# EAGLE design pcie-led (EAGLE 7.6.0)
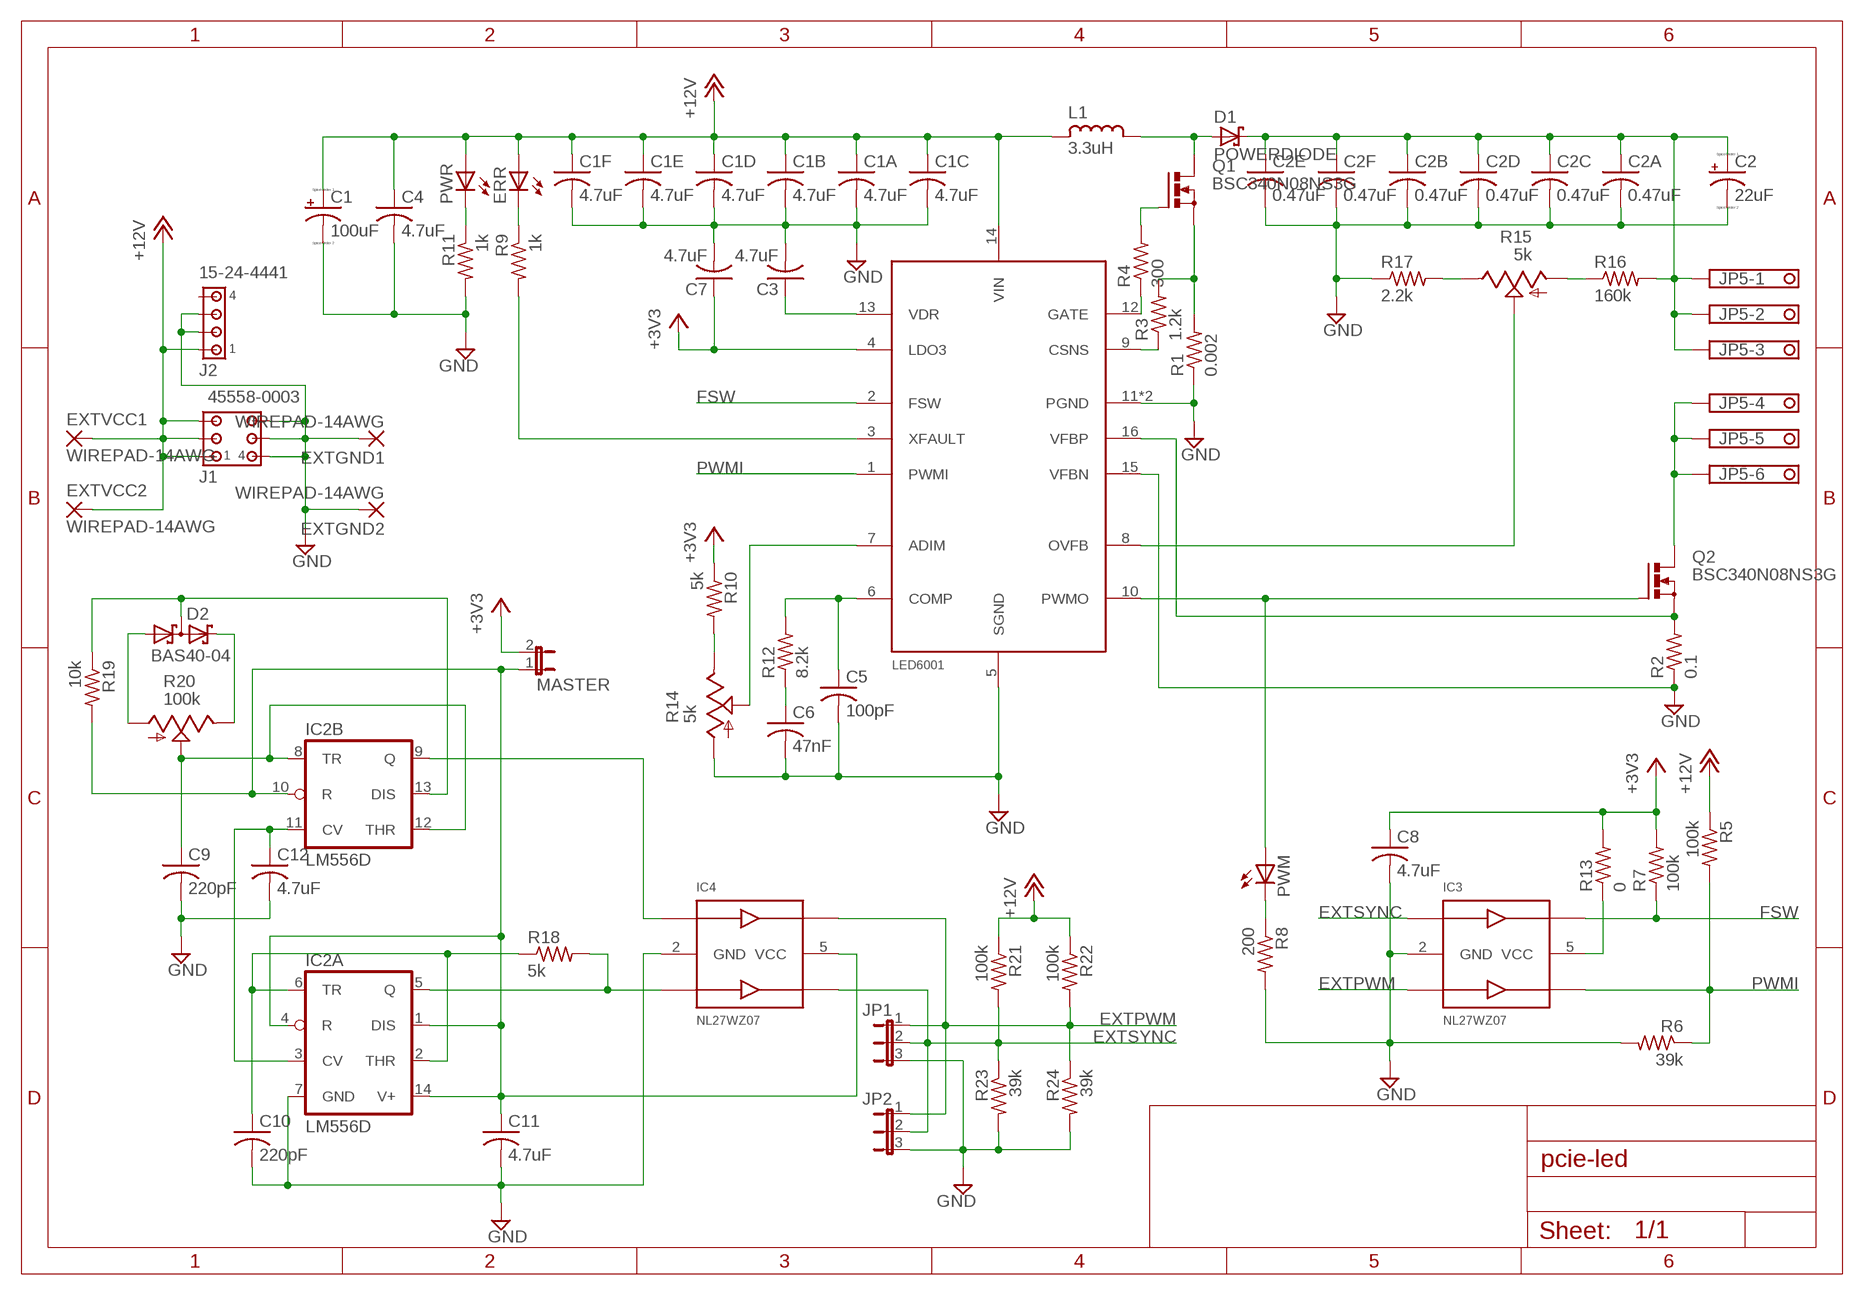
[diagram p0: schematic, sheet 1]

## Parts
C1  100uF  CPOL-USE3.5-8  [E3,5-8]
C1A  4.7uF  C-USC0805  [C0805]
C1B  4.7uF  C-USC0805  [C0805]
C1C  4.7uF  C-USC0805  [C0805]
C1D  4.7uF  C-USC0805  [C0805]
C1E  4.7uF  C-USC0805  [C0805]
C1F  4.7uF  C-USC0805  [C0805]
C2  22uF  CPOL-USE3.5-8  [E3,5-8]
C2A  0.47uF  C-USC0805  [C0805]
C2B  0.47uF  C-USC0805  [C0805]
C2C  0.47uF  C-USC0805  [C0805]
C2D  0.47uF  C-USC0805  [C0805]
C2E  0.47uF  C-USC0805  [C0805]
C2F  0.47uF  C-USC0805  [C0805]
C3  4.7uF  C-USC0603  [C0603]
C4  4.7uF  C-USC0603  [C0603]
C5  100pF  C-USC0603  [C0603]
C6  47nF  C-USC0603  [C0603]
C7  4.7uF  C-USC0603  [C0603]
C8  4.7uF  C-USC0603  [C0603]
C9  220pF  C-USC0603  [C0603]
C10  220pF  C-USC0603  [C0603]
C11  4.7uF  C-USC0603  [C0603]
C12  4.7uF  C-USC0603  [C0603]
D1  POWERDIODE  [LFPACK56-TO277]
D2  BAS40-04  [SOT23]
ERR  LEDCHIP-LED0805  [CHIP-LED0805]
EXTGND1  WIREPAD-14AWG  [WIREPAD-14AWG]
EXTGND2  WIREPAD-14AWG  [WIREPAD-14AWG]
EXTVCC1  WIREPAD-14AWG  [WIREPAD-14AWG]
EXTVCC2  WIREPAD-14AWG  [WIREPAD-14AWG]
IC1  LED6001  [HTSSOP-16]
IC2  LM556D  [SO14]
IC3  NL27WZ07  [SOT363]
IC4  NL27WZ07  [SOT363]
J1  45558-0003  [45558-0003]
J2  15-24-4441  [15-24-4441]
JP1  JP2E  [JP2]
JP2  JP2E  [JP2]
JP5  OSTTE06  [OSTTE06]
L1  3.3uH  SRP1770TA  [SRP1770TA]
MASTER  JP1E  [JP1]
PWM  LEDCHIP-LED0805  [CHIP-LED0805]
PWR  LEDCHIP-LED0805  [CHIP-LED0805]
Q1  BSC340N08NS3G  [PG-TDSON-8]
Q2  BSC340N08NS3G  [PG-TDSON-8]
R1  0.002  R-US_R1206  [R1206]
R2  0.1  R-US_R2512  [R2512]
R3  1.2k  R-US_R0603  [R0603]
R4  300  R-US_R0603  [R0603]
R5  100k  R-US_R0603  [R0603]
R6  39k  R-US_R0603  [R0603]
R7  100k  R-US_R0603  [R0603]
R8  200  R-US_R0603  [R0603]
R9  1k  R-US_R0603  [R0603]
R10  5k  R-US_R0603  [R0603]
R11  1k  R-US_R0603  [R0603]
R12  8.2k  R-US_R0603  [R0603]
R13  0  R-US_R0603  [R0603]
R14  5k  ST4ETB  [ST-4EB]
R15  5k  ST4ETB  [ST-4EB]
R16  160k  R-US_R0603  [R0603]
R17  2.2k  R-US_R0603  [R0603]
R18  5k  R-US_R0603  [R0603]
R19  10k  R-US_R0603  [R0603]
R20  100k  P260T  [P260T]
R21  100k  R-US_R0603  [R0603]
R22  100k  R-US_R0603  [R0603]
R23  39k  R-US_R0603  [R0603]
R24  39k  R-US_R0603  [R0603]

## Nets
+3V3: C7.1 C8.1 IC1.4(LDO3) MASTER.2 R7.2 R10.1 R13.2
+12V: C1.+ C1A.1 C1B.1 C1C.1 C1D.1 C1E.1 C1F.1 C4.1 ERR.A EXTVCC1.TP(P) EXTVCC2.TP(P) IC1.14(VIN) J1.1 J1.2 J1.3 J2.1 L1.P$1 PWR.A R5.1 R21.1 R22.1
CSNS: Q1.1(S) Q1.2(S) Q1.3(S) R1.2 R3.2
EXTPWM: IC3.3(IN2) IC4.6(OUT1) JP1.1 JP2.1 R22.2 R24.1
EXTSYNC: IC3.1(IN1) IC4.4(OUT2) JP1.2 JP2.2 R21.2 R23.1
FSW: IC1.2(FSW) IC3.6(OUT1) R7.1
GND: C1.- C1A.2 C1B.2 C1C.2 C1D.2 C1E.2 C1F.2 C2.- C2A.2 C2B.2 C2C.2 C2D.2 C2E.2 C2F.2 C3.2 C4.2 C5.2 C6.2 C7.2 C8.2 C9.2 C10.2 C11.2 C12.2 EXTGND1.TP(P) EXTGND2.TP(P) IC1.5(SGND) IC1.11(PGND) IC1.15(VFBN) IC1.PAD(PGND) IC2.7(A:GND) IC3.2(GND) IC4.2(GND) J1.4 J1.5 J1.6 J2.2 J2.3 JP1.3 JP2.3 R1.1 R2.1 R6.2 R8.2 R11.2 R14.1(A) R17.1 R23.2 R24.2
L+: D1.A L1.P$2 Q1.5(D) Q1.6(D) Q1.7(D) Q1.8(D) Q1.TH(D)
LED+: C2.+ C2A.1 C2B.1 C2C.1 C2D.1 C2E.1 C2F.1 D1.C1(C) D1.C2(C) D1.C3(C) D1.C4(C) D1.TH(C) JP5.1 JP5.2 JP5.3 R16.2
LED-: JP5.4 JP5.5 JP5.6 Q2.5(D) Q2.6(D) Q2.7(D) Q2.8(D) Q2.TH(D)
N$1: PWM.C R8.1
N$2: IC1.10(PWMO) PWM.A Q2.4(G)
N$3: Q1.4(G) R4.2
N$4: C11.1 IC2.1(A:DIS) IC2.4(A:R) IC2.10(B:R) IC2.14(A:V+) IC4.5(VCC) MASTER.1 R19.2
N$5: IC1.12(GATE) R4.1
N$6: IC2.5(A:Q) IC4.3(IN2) R18.2
N$7: R15.1(A) R16.1
N$8: IC2.9(B:Q) IC4.1(IN1)
N$9: C5.1 IC1.6(COMP) R12.2
N$10: C6.1 R12.1
N$11: IC1.8(OVFB) R15.2(S)
N$12: IC1.7(ADIM) R14.2(S)
N$13: R15.3(E) R17.2
N$14: R10.2 R14.3(E)
N$15: IC1.9(CSNS) R3.1
N$16: IC3.5(VCC) R13.1
N$18: C12.1 IC2.3(A:CV) IC2.11(B:CV)
N$21: C10.1 IC2.2(A:THR) IC2.6(A:TR) R18.1
N$22: ERR.C R9.1
N$23: D2.2(C2) R20.3(E)
N$24: D2.1(A1) R20.1(A)
N$25: C9.1 IC2.8(B:TR) IC2.12(B:THR) R20.2(S)
N$26: D2.3(C1A2) IC2.13(B:DIS) R19.1
N$27: PWR.C R11.1
N$29: C3.1 IC1.13(VDR)
PWMI: IC1.1(PWMI) IC3.4(OUT2) R5.2 R6.1
VFBP: IC1.16(VFBP) Q2.1(S) Q2.2(S) Q2.3(S) R2.2
XFAULT: IC1.3(XFAULT) R9.2
Unconnected: J2.4

## Library data of the parts
C1 C2 = resistor:CPOL-US: POLARIZED CAPACITOR, American symbol
C1A C1B C1C C1D C1E C1F C2A C2B C2C C2D C2E C2F C3-C12 = resistor:C-US: CAPACITOR, American symbol
D1 = parts:POWERDIODE
D2 = diode:BAS40-04: Silicon Schottky Diodes General-purpose diode for high-speed switching
ERR PWM PWR = led:LED: LED OSRAM: - CHIPLED LG R971, LG N971, LY N971, LG Q971, LY Q971, LO R971, LY R971 LH N974, LH R974 LS Q976, LO Q976, LY Q976 LO Q996 - Hyper CHIPLED LW Q18S LB Q993, LB Q99A, LB R99A - SideLED LS A670, LO A670, LY A670, LG A670, LP A670 LB A673, LV A673, LT A673, LW A673 LH A674 LY A675 LS A676, LA A676, LO A676, LY A676, LW A676 LS A679, LY A679, LG A679 - Hyper Micro SIDELED® LS Y876, LA Y876, LO Y876, LY Y876 LT Y87S - SmartLED LW L88C, LW L88S LB L89C, LB L89S, LG L890 LS L89K, LO L89K, LY L89K LS L896, LA L896, LO L896, LY L896 - TOPLED LS T670, LO T670, LY T670, LG T670, LP T670 LSG T670, LSP T670, LSY T670, LOP T670, LYG T670 LG T671, LOG T671, LSG T671 LB T673, LV T673, LT T673, LW T673 LH T674 LS T676, LA T676, LO T676, LY T676, LB T676, LH T676, LSB T676, LW T676 LB T67C, LV T67C, LT T67C, LS T67K, LO T67K, LY T67K, LW E67C LS E67B, LA E67B, LO E67B, LY E67B, LB E67C, LV E67C, LT E67C LW T67C LS T679, LY T679, LG T679 LS T770, LO T770, LY T770, LG T770, LP T770 LB T773, LV T773, LT T773, LW T773 LH T774 LS E675, LA E675, LY E675, LS T675 LS T776, LA T776, LO T776, LY T776, LB T776 LHGB T686 LT T68C, LB T68C - Hyper Mini TOPLED® LB M676 - Mini TOPLED Santana® LG M470 LS M47K, LO M47K, LY M47K Source: http://www.osram.convergy.de LUXEON: - LUMILED® LXK2-PW12-R00, LXK2-PW12-S00, LXK2-PW14-U00, LXK2-PW14-V00 LXK2-PM12-R00, LXK2-PM12-S00, LXK2-PM14-U00 LXK2-PE12-Q00, LXK2-PE12-R00, LXK2-PE12-S00, LXK2-PE14-T00, LXK2-PE14-U00 LXK2-PB12-K00, LXK2-PB12-L00, LXK2-PB12-M00, LXK2-PB14-N00, LXK2-PB14-P00, LXK2-PB14-Q00 LXK2-PR12-L00, LXK2-PR12-M00, LXK2-PR14-Q00, LXK2-PR14-R00 LXK2-PD12-Q00, LXK2-PD12-R00, LXK2-PD12-S00 LXK2-PH12-R00, LXK2-PH12-S00 LXK2-PL12-P00, LXK2-PL12-Q00, LXK2-PL12-R00 Source: www.luxeon.com KINGBRIGHT: KA-3528ASYC Source: www.kingbright.com
EXTGND1 EXTGND2 EXTVCC1 EXTVCC2 = parts:WIREPAD-14AWG
IC1 = parts:LED6001: PWM-dimmable single channel LED driver with integrated boost controller
IC2 = linear:*556: Dual TIMER
IC3 IC4 = parts:NL27WZ07
J1 = parts:45558-0003: Mini-Fit® Jr™ 45558 6 Positions Header, Shrouded Connector 0.165" (4.20mm) Through Hole, Right Angle Tin
J2 = parts:15-24-4441: 4 Positions Header, Shrouded Connector 0.200" (5.08mm) Through Hole, Right Angle Tin
JP1 JP2 = parts:JP2E: JUMPER
JP5 = parts:OSTTE06
L1 = parts:SRP1770TA: SRP1770TA Series - Shielded Power Inductors
MASTER = parts:JP1E: JUMPER
Q1 Q2 = parts:BSC340N08NS3G: OptiMOS TM 3 Power-Transistor BSC340N08NS3 G Source: Data sheet <http://www.infineon.com/dgdl/BSC340N08NS3G_rev2.4.pdf?folderId=db3a304313b8b5a60113cee8763b02d7&fileId=db3a30431add1d95011ae81c21f2563a>
R1-R13 R16-R19 R21-R24 = resistor:R-US_: RESISTOR, American symbol
R14 R15 = parts:ST4ETB
R20 = parts:P260T

## Board
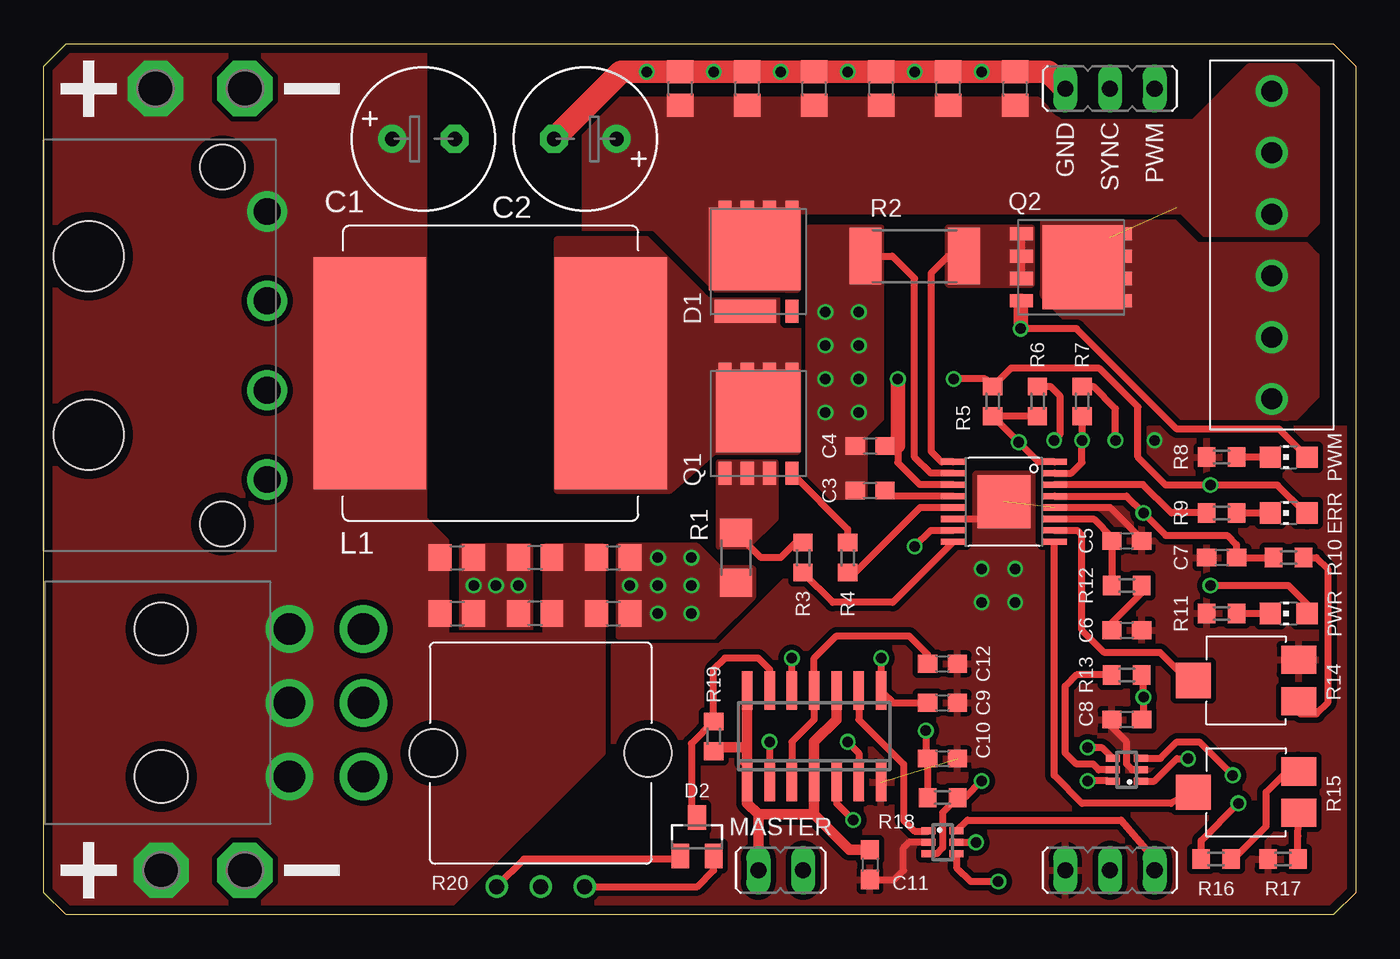
[diagram p1: board, top side]
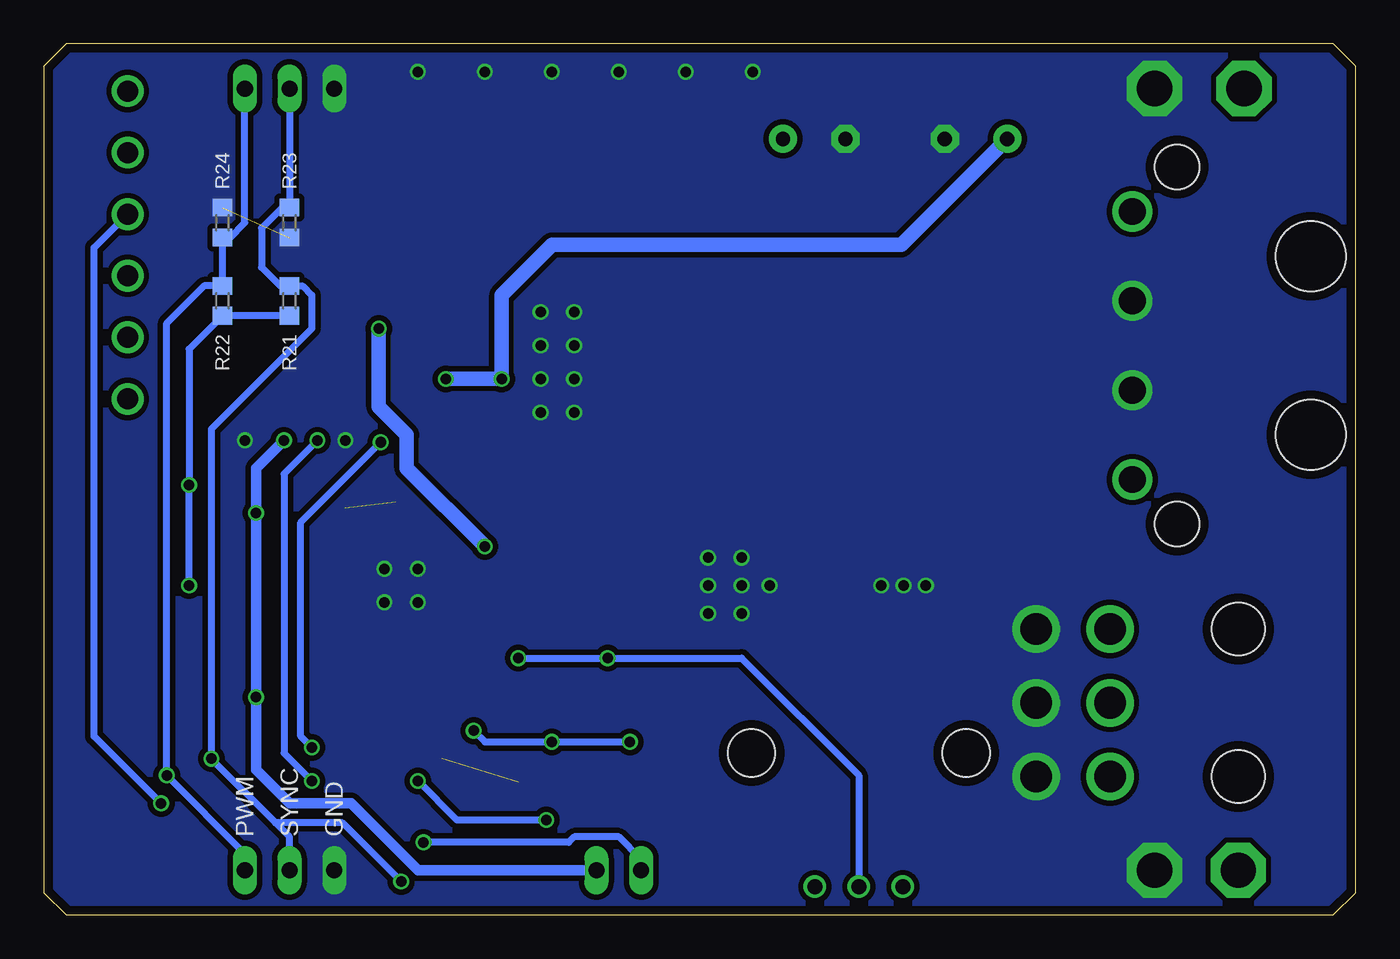
[diagram p2: board, bottom side, seen from below]

Size 74.61 x 49.53 mm. Coordinates in mm from the lower left corner, seen from the top.
Outline: 1.27,0 0,1.27 0,48.26 1.27,49.53 73.34,49.53 74.61,48.26 74.61,1.27 73.34,0 1.27,0
Copper layers (1*16): Top 0.035mm / dielectric 1.6mm / Bottom 0.035mm
Design rules "Elecrow_2-layer_PCB_eagle_rule": minimum track width 6mil, minimum drill 12mil, track to track 6mil, track to pad 6mil, pad to pad 6mil, via to via 8mil, smd to smd 0mil, copper to edge 20mil, drill to drill 10mil, minimum pad ring 6mil, minimum via ring 6mil, stop-mask expansion 0mil, vias tented up to drill 100mil, thermal gap 10mil

### Footprints (pad centres in the part's own frame; a part is rotated, then mirrored left to right if it is on the bottom)
E3,5-8 = drill 0.813 pad 1.6: + -1.778,0 | drill 0.813 pad 1.6 octagon: - 1.778,0
C0805 = smd 1.3 x 1.5: 1 -0.95,0; 2 0.95,0
C0603 = smd 1.1 x 1: 1 -0.85,0; 2 0.85,0
LFPACK56-TO277 = smd 1.3 x 3.5: A -2.825,0.735 | smd 1.3 x 0.75: C1 2.825,1.905; C2 2.825,0.635; C3 2.825,-0.635; C4 2.825,-1.905; NC -2.825,-1.905 | smd 4.7 x 5.2: TH 0.725,0.2
SOT23 = smd 1 x 1.4: 1 -0.95,-1.1; 2 0.95,-1.1; 3 0,1.1
CHIP-LED0805 = smd 1.2 x 1.2: A 0,-1.05; C 0,1.05
WIREPAD-14AWG = drill 2.007 pad 3.15 octagon: TP 0,0
HTSSOP-16 = smd 0.35 x 1.4: 1 -2.275,2.875; 2 -1.625,2.875; 3 -0.975,2.875; 4 -0.325,2.875; 5 0.325,2.875; 6 0.975,2.875; 7 1.625,2.875; 8 2.275,2.875; 9 2.275,-2.875; 10 1.625,-2.875; 11 0.975,-2.875; 12 0.325,-2.875; 13 -0.325,-2.875; 14 -0.975,-2.875; 15 -1.625,-2.875; 16 -2.275,-2.875 | smd 3 x 3: PAD 0,0
SO14 = smd 0.6 x 2.2: 1 -3.81,-2.6; 2 -2.54,-2.6; 3 -1.27,-2.6; 4 0,-2.6; 5 1.27,-2.6; 6 2.54,-2.6; 7 3.81,-2.6; 8 3.81,2.6; 9 2.54,2.6; 10 1.27,2.6; 11 0,2.6; 12 -1.27,2.6; 13 -2.54,2.6; 14 -3.81,2.6
SOT363 = smd 0.4 x 0.8: 1 -0.65,-0.8; 2 0,-0.8; 3 0.65,-0.8; 4 0.65,0.8; 5 0,0.8; 6 -0.65,0.8
45558-0003 = drill 1.8: 1 -4.2,0; 2 0,0; 3 4.2,0; 4 -4.2,-4.2; 5 0,-4.2; 6 4.2,-4.2 | hole 3: 4.2,7.3; -4.2,7.3
15-24-4441 = drill 1.524: 1 7.62,-5.08; 2 2.54,-5.08; 3 -2.54,-5.08; 4 -7.62,-5.08 | hole 2.54: 10.16,-2.54; -10.16,-2.54 | hole 3.988: 5.08,5.08; -5.08,5.08
JP2 = drill 0.914 long: 1 -2.54,0; 2 0,0; 3 2.54,0
OSTTE06 = drill 1.2: 1 -8.75,0; 2 -5.25,0; 3 -1.75,0; 4 1.75,0; 5 5.25,0; 6 8.75,0
SRP1770TA = smd 6.4 x 13.2: P$1 6.85,0; P$2 -6.85,0
JP1 = drill 0.914 long: 1 0,-1.27; 2 0,1.27
PG-TDSON-8 = smd 1.3 x 0.75: 1 -2.825,1.905; 2 -2.825,0.635; 3 -2.825,-0.635; 4 -2.825,-1.905; 5 2.825,-1.905; 6 2.825,-0.635; 7 2.825,0.635; 8 2.825,1.905 | smd 4.7 x 4.8: TH 0.725,0
R1206 = smd 1.6 x 1.803: 1 -1.422,0; 2 1.422,0
R2512 = smd 1.8 x 3.2: 1 -2.8,0; 2 2.8,0
R0603 = smd 1 x 1.1: 1 -0.85,0; 2 0.85,0
ST-4EB = smd 2 x 1.6: 1 2.8,1.175; 3 2.8,-1.175 | smd 2 x 2: 2 -3.2,0
P260T = drill 0.85: 1 -2.5,-7.6; 2 0,-7.6; 3 2.5,-7.6 | hole 2.7: -6.1,0; 6.1,0

### Placement (x,y rotation side)
C1  21.59,44.13 0 top
C1A  23.5,20.32 0 top
C1B  23.5,17.14 0 top
C1C  27.94,20.32 180 top
C1D  27.94,17.14 180 top
C1E  32.38,20.32 0 top
C1F  32.38,17.14 0 top
C2  30.8,44.13 180 top
C2A  36.2,46.99 90 top
C2B  40.01,46.99 90 top
C2C  43.81,46.99 90 top
C2D  47.62,46.99 90 top
C2E  51.44,46.99 90 top
C2F  55.24,46.99 90 top
C3  46.99,24.13 180 top
C4  46.99,26.67 180 top
C5  61.59,21.27 0 top
C6  61.59,16.19 0 top
C7  66.99,20.32 180 top
C8  61.59,11.11 180 top
C9  51.12,12.06 0 top
C10  51.12,8.89 0 top
C11  46.99,2.86 270 top
C12  51.12,14.29 0 top
D1  40.64,37.15 90 top
D2  37.15,4.45 0 top
ERR  70.8,22.86 90 top
EXTGND1  11.43,2.54 0 top
EXTGND2  11.43,46.99 0 top
EXTVCC1  6.67,2.54 0 top
EXTVCC2  6.35,46.99 0 top
IC1  54.61,23.5 270 top
IC2  43.81,10.16 0 top
IC3  61.59,8.26 90 top
IC4  51.12,4.13 270 top
J1  13.97,12.06 90 top
J2  7.62,32.38 90 top
JP1  60.64,46.99 180 top
JP2  60.64,2.54 180 top
JP5  69.85,38.1 270 top
L1  25.4,30.8 180 top
MASTER  41.91,2.54 270 top
PWM  70.8,26.04 90 top
PWR  70.8,17.14 90 top
Q1  40.64,27.94 90 top
Q2  58.42,36.83 0 top
R1  39.37,20.32 90 top
R2  49.53,37.47 0 top
R3  43.18,20.32 90 top
R4  45.72,20.32 90 top
R5  53.98,29.21 270 top
R6  56.52,29.21 90 top
R7  59.05,29.21 90 top
R8  66.99,26.04 180 top
R9  66.99,22.86 180 top
R10  70.8,20.32 0 top
R11  66.99,17.14 180 top
R12  61.59,18.73 180 top
R13  61.59,13.65 0 top
R14  68.58,13.34 0 top
R15  68.58,6.99 0 top
R16  66.67,3.17 180 top
R17  70.48,3.17 0 top
R18  51.12,6.67 0 top
R19  38.1,10.16 270 top
R20  28.26,9.21 0 top
R21  60.64,34.92 90 bottom
R22  64.45,34.92 90 bottom
R23  60.64,39.37 270 bottom
R24  64.45,39.37 90 bottom

### Tracks (layer width: path | path; a pad name or v marks a point on that pad's centre or on a via)
+3V3  (via drill 0.6)
  Top 0.406: IC1.4 61.59,23.82 v62.55,22.86 63.82,21.59 67.31,21.59 67.84,21.06 C7.1 R10.1 | 59.16,30.06 R7.2 | 59.16,30.16 R7.2 | R7.2 59.69,30.06 60.96,28.79 v60.96,26.99 | C8.1 62.55,11.21 v62.55,12.38 62.55,13.55 R13.2
  Bottom 0.61: v60.96,26.99 62.55,25.4 v62.55,22.86 v62.55,12.38 62.55,8.26 60.64,6.35 57.15,6.35 53.34,2.54 MASTER.2
+12V  (via drill 0.6)
  Top 0.406: IC1.14 49.83,24.47 48.58,25.72 48.58,26.67 | C4.1 48.26,26.67 | 71.85,22.45 ERR.A 71.75,22.86 70.17,24.45 v66.36,24.45 63.82,24.45 62.23,26.04 62.23,28.89 60.01,31.11 55.03,31.11 R5.1 53.55,30.48 v51.75,30.48 | PWR.A 71.85,17.68 70.8,18.73 v66.36,18.73
  Top 0.813: v48.58,30.48 48.58,26.67 48.26,26.67
  Top 2.54: 18.92,34.42 L1.P$1
  Bottom 0.406: v66.36,18.73 v66.36,24.45 66.36,32.17 R22.1 R21.1
  Bottom 0.813: C1.+ 25.84,38.1 45.72,38.1 48.58,35.24 v48.58,30.48 v51.75,30.48
  pour Top (isolate 0.305, no thermals): 31.75,20.95 31.75,9.21 22.86,0.32 0.32,0.32 0.32,49.21 21.59,49.21 21.59,22.54 22.86,21.27 22.86,15.88 28.57,15.88 28.57,20.95
CSNS
  Top 0.406: R3.2 42.76,21.17 41.91,20.32 40.79,20.32 R1.2
  pour Top (rank 2, no thermals): 38.42,25.72 41.59,25.72 41.59,22.54 40.01,20.95 38.42,20.95
EXTPWM  (via drill 0.6)
  Top 0.406: 63.18,1.59 JP2.1 63.18,3.17 61.28,5.4 52.54,5.4 IC4.6 | IC3.3 63.52,8.9 64.45,9.84 65.72,9.84 v67.63,7.94
  Bottom 0.406: JP2.1 63.18,3.49 v67.63,7.94 67.63,33.66 65.51,35.77 R22.2 R24.1 64.03,38.52 63.18,39.37 JP1.1
EXTSYNC  (via drill 0.6)
  Top 0.406: JP2.2 60.64,2.22 | IC4.4 51.92,2.69 52.7,1.91 v54.29,1.91 | IC3.1 63.17,7.61 64.45,8.89 v65.09,8.89
  Bottom 0.406: JP2.2 60.64,4.45 61.44,5.24 | 61.44,5.24 v65.09,8.89 65.09,27.62 59.37,33.34 59.37,35.24 59.91,35.77 R21.2 61.17,35.77 62.23,36.83 62.23,39.05 61.06,40.22 R23.1 JP1.2 | v54.29,1.91 57.63,5.24 61.44,5.24
FSW  (via drill 0.6)
  Top 0.406: R7.1 v59.05,26.99 59.05,25.72 58.46,25.12 IC1.2 | 59.39,7.61 v59.37,7.62 60.49,7.62 IC3.6
  Bottom 0.406: v59.37,7.62 60.96,9.21 60.96,25.08 v59.05,26.99
GND  (via drill 0.6)  (3 unrouted)
  Top 0.406: IC1.11 53.63,22.52 IC1.PAD | R2.1 48.26,37.47 49.53,36.2 49.53,26.04 50.45,25.12 IC1.15 | IC1.5 60.65,23.17 62.45,21.38 C5.2 | R6.2 57.25,30.06 57.78,29.53 57.78,27.3 v57.47,26.99 | C8.2 60.74,10.69 61.59,9.84 61.59,8.57 61.91,8.26 IC3.2 | IC4.2 49.21,4.13 48.9,3.81 48.9,2.54 48.36,2.01 C11.2
  Top 1.27: C2B.2 | JP1.3 57.15,47.94 C2F.2 C2E.2 C2D.2 C2C.2 C2B.2 | C2A.2 C2B.2 | C2.- 32.83,47.94 v34.29,47.94 C2A.2
  other vias: 46.35,34.29 46.35,32.38 46.35,30.48 46.35,28.57 44.45,28.57 44.45,30.48 44.45,32.38 44.45,34.29 34.92,20.32 36.83,20.32 36.83,18.73 36.83,17.14 34.92,17.14 34.92,18.73 33.34,18.73 24.45,18.73 25.72,18.73 26.99,18.73 53.34,19.68 55.24,19.68 55.24,17.78 53.34,17.78 63.18,26.99 38.1,47.94 41.91,47.94 45.72,47.94 49.53,47.94 53.34,47.94
  pour Top (rank 4, no thermals): 47.62,39.05 43.5,39.05 43.5,25.08 44.77,23.81 46.67,23.81 46.67,27.3 47.62,28.26
  pour Top (isolate 0.305, no thermals): 40.32,19.68 38.42,19.68 37.15,20.95 32.7,20.95 32.7,15.88 38.1,15.88 40.32,18.1
  pour Top (no thermals): 53.02,25.08 56.2,25.08 56.2,20.64 53.02,20.64
  pour Top (rank 2, no thermals): 23.81,20.95 27.62,20.95 27.62,16.19 23.81,16.19
  pour Top (isolate 0.305, rank 2): 74.3,0.32 74.3,27.62 62.87,27.62 57.78,20.95 43.81,20.64 38.42,15.24 32.38,15.24 32.38,8.89 23.81,0.32
  pour Bottom (isolate 0.305, no thermals): 74.3,0.32 0.32,0.32 0.32,49.21 74.3,49.21
L+
  pour Top (isolate 0.305, no thermals): 42.86,34.92 42.86,26.35 38.1,26.35 35.56,24.13 29.21,24.13 29.21,38.42 34.29,38.42 37.78,34.92
LED+  (via drill 0.6)
  Top 0.406: 65.83,2.96 R16.2 65.83,4.23 v67.94,6.35
  Bottom 0.406: JP5.3 71.75,37.95 71.75,10.16 v67.94,6.35
  pour Top (isolate 0.305, rank 2, no thermals): 42.86,35.56 33.66,35.56 30.8,38.1 30.8,46.35 56.52,46.35 57.78,45.09 65.41,45.09 68.58,48.26 71.12,48.26 72.39,46.99 72.39,39.37 71.75,38.73 66.04,38.73 64.77,40.01 42.86,40.01
LED-
  pour Top (isolate 0.305, rank 3, no thermals): 56.83,39.37 56.83,35.24 63.82,28.26 71.12,28.26 72.39,29.53 72.39,37.47 71.75,38.1 65.72,38.1 64.45,39.37
N$1
  Top 0.406: PWM.C R8.1
N$2  (via drill 0.6)
  Top 0.406: v49.53,20.95 50.45,21.87 IC1.10 | PWM.A 70.27,27.62 64.45,27.62 58.74,33.34 v55.56,33.34
  Top 0.813: v55.56,33.34 55.56,34.89 Q2.4
  Bottom 0.813: v49.53,20.95 53.98,25.4 53.98,27.3 55.56,28.89 v55.56,33.34
N$3
  Top 0.406: Q1.4 45.72,21.94 R4.2
N$4  (via drill 0.6)
  Top 0.406: 39.79,8.68 40.01,8.89 | 39.96,12.8 IC2.14 | C11.1 46.67,3.39 | IC4.5 v53.02,4.13
  Top 0.61: IC2.14 40.01,9.53 | 40.01,9.53 40.01,8.89 IC2.1 40.01,6.35 40.64,5.71 | 43.81,5.71 40.64,5.71 | IC2.10 45.09,11.11 43.81,9.84 IC2.4 43.81,5.71 | MASTER.1 40.64,5.71 | 43.81,5.71 45.82,3.71 C11.1 | R19.2 38.31,9.53 40.01,9.53
  Bottom 0.406: MASTER.1 40.64,3.17 41.91,4.45 44.45,4.45 44.77,4.13 v53.02,4.13
N$5
  Top 0.406: IC1.12 49.84,23.17 46.14,19.47 R4.1
N$6  (via drill 0.6)
  Top 0.406: IC4.3 50.33,3.49 50.8,3.49 51.12,3.81 51.12,5.82 R18.2 52.39,6.67 v53.34,7.62 | IC2.5 45.09,6.35 v46.04,5.4
  Bottom 0.406: v46.04,5.4 51.12,5.4 v53.34,7.62
N$7
  Top 0.406: R16.1 67.53,3.04 69.53,5.04 69.53,6.99 71.34,8.79 R15.1
N$8
  Top 0.406: IC2.9 46.35,11.11 48.9,8.57 48.9,5.4 49.53,4.76 50.3,4.76 IC4.1
N$9
  Top 0.406: IC1.6 59.71,22.52 60.74,21.49 C5.1 R12.2
N$10
  Top 0.406: C6.1 60.74,16.61 62.45,18.31 R12.1
N$11
  Top 0.406: IC1.8 57.47,19.93 57.47,7.94 59.05,6.35 64.11,6.35 R15.2
N$12
  Top 0.406: IC1.7 58.77,21.87 59.05,21.59 59.05,16.19 60.33,14.92 63.5,14.92 65.38,13.04 R14.2
N$13
  Top 0.406: R17.2 71.33,4.5 R15.3
N$14
  Top 0.406: R14.3 71.47,11.43 72.39,11.43 73.03,12.06 73.03,19.68 72.39,20.32 R10.2
N$15
  Top 0.406: R3.1 44.87,17.78 48.3,17.78 IC1.9
N$16
  Top 0.406: R13.1 58.74,13.65 58.1,13.02 58.1,9.21 58.74,8.57 59.69,8.57 60.01,8.26 IC3.5
N$18
  Top 0.406: IC2.3 42.55,9.84 43.81,11.11 IC2.11 43.81,14.61 45.09,15.88 49.21,15.88 50.27,14.82 C12.1
N$21  (via drill 0.6)
  Top 0.406: v41.27,9.84 IC2.2 | v45.72,9.84 46.35,9.21 IC2.6 | v50.16,10.48 50.16,8.99 C10.1 R18.1
  Bottom 0.406: v41.27,9.84 v45.72,9.84 49.53,9.84 v50.16,10.48
N$22
  Top 0.406: R9.1 ERR.C
N$23
  Top 0.406: R20.3 37.17,1.61 38.1,2.54 D2.2
N$24
  Top 0.406: R20.1 25.76,1.63 27.3,3.17 36.03,3.17 D2.1
N$25  (via drill 0.6)
  Top 0.406: IC2.12 v42.55,14.61 | v47.62,14.61 IC2.8 48.32,12.06 C9.1
  Bottom 0.406: v47.62,14.61 v42.55,14.61 34.92,14.61 28.26,7.94 R20.2
N$26
  Top 0.406: IC2.13 41.27,13.97 40.64,14.61 38.73,14.61 38.1,13.97 R19.1 36.83,9.74 36.83,5.86 D2.3
N$27
  Top 0.406: R11.1 PWR.C
N$29
  Top 0.406: IC1.13 48.25,23.82 C3.1
PWMI  (via drill 0.6)
  Top 0.406: R6.1 R5.2 v55.45,26.88 56.56,25.77 IC1.1 | v59.37,9.53 60.17,9.53 IC3.4
  Bottom 0.406: v55.45,26.88 60.01,22.33 60.01,10.16 v59.37,9.53
VFBP
  Top 0.406: Q2.1 Q2.2 Q2.3 | IC1.16 51.06,25.77 50.48,26.35 50.48,36.51 51.44,37.47 R2.2
  pour Top (no thermals): 56.2,39.05 51.44,39.05 51.44,35.88 56.2,35.88
XFAULT
  Top 0.406: R9.2 64.14,22.86 62.52,24.47 IC1.3

### Text on the board
tPlace: GND | SYNC | PWM
bPlace: GND | SYNC | PWM
bStop: PCIe LED Driver / Rev Alpha / 11/22/2016